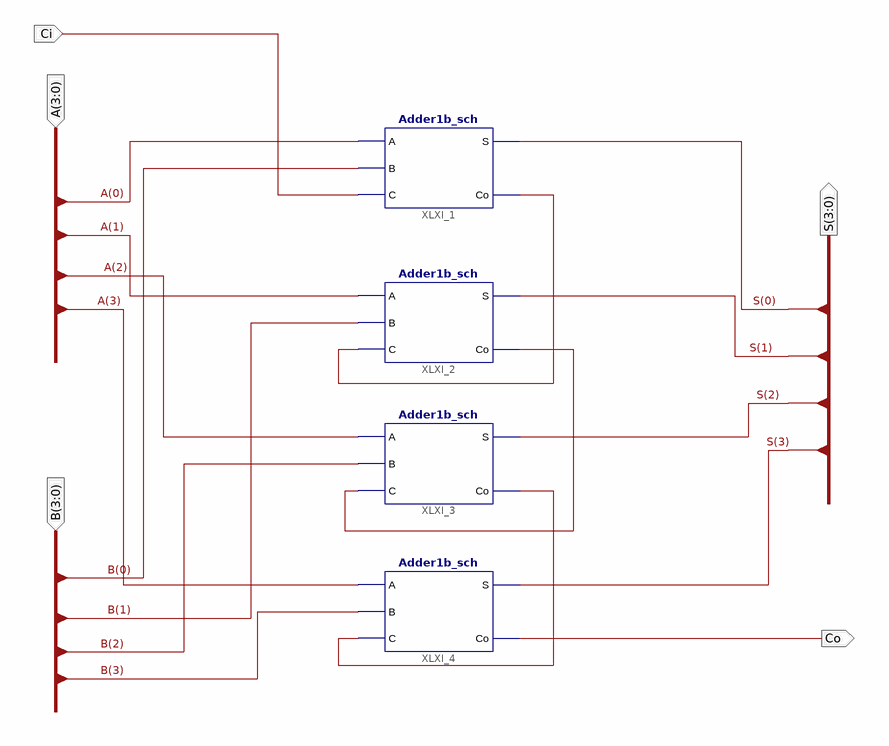
[diagram p0: schematic sheet 1]
// Xilinx ISE schematic Adder4b_sch.sch (kintex7) as structural Verilog: 4 symbols, 5 ports
module Adder4b_sch (
  input  [3:0] A,
  input  [3:0] B,
  input  Ci,
  output Co,
  output [3:0] S
);

  wire XLXN_1, XLXN_2, XLXN_4;

  Adder1b_sch XLXI_1 (.A(A[0]), .B(B[0]), .C(Ci), .S(S[0]), .Co(XLXN_1));
  Adder1b_sch XLXI_2 (.A(A[1]), .B(B[1]), .C(XLXN_1), .S(S[1]), .Co(XLXN_2));
  Adder1b_sch XLXI_3 (.A(A[2]), .B(B[2]), .C(XLXN_2), .S(S[2]), .Co(XLXN_4));
  Adder1b_sch XLXI_4 (.A(A[3]), .B(B[3]), .C(XLXN_4), .S(S[3]), .Co(Co));
endmodule
